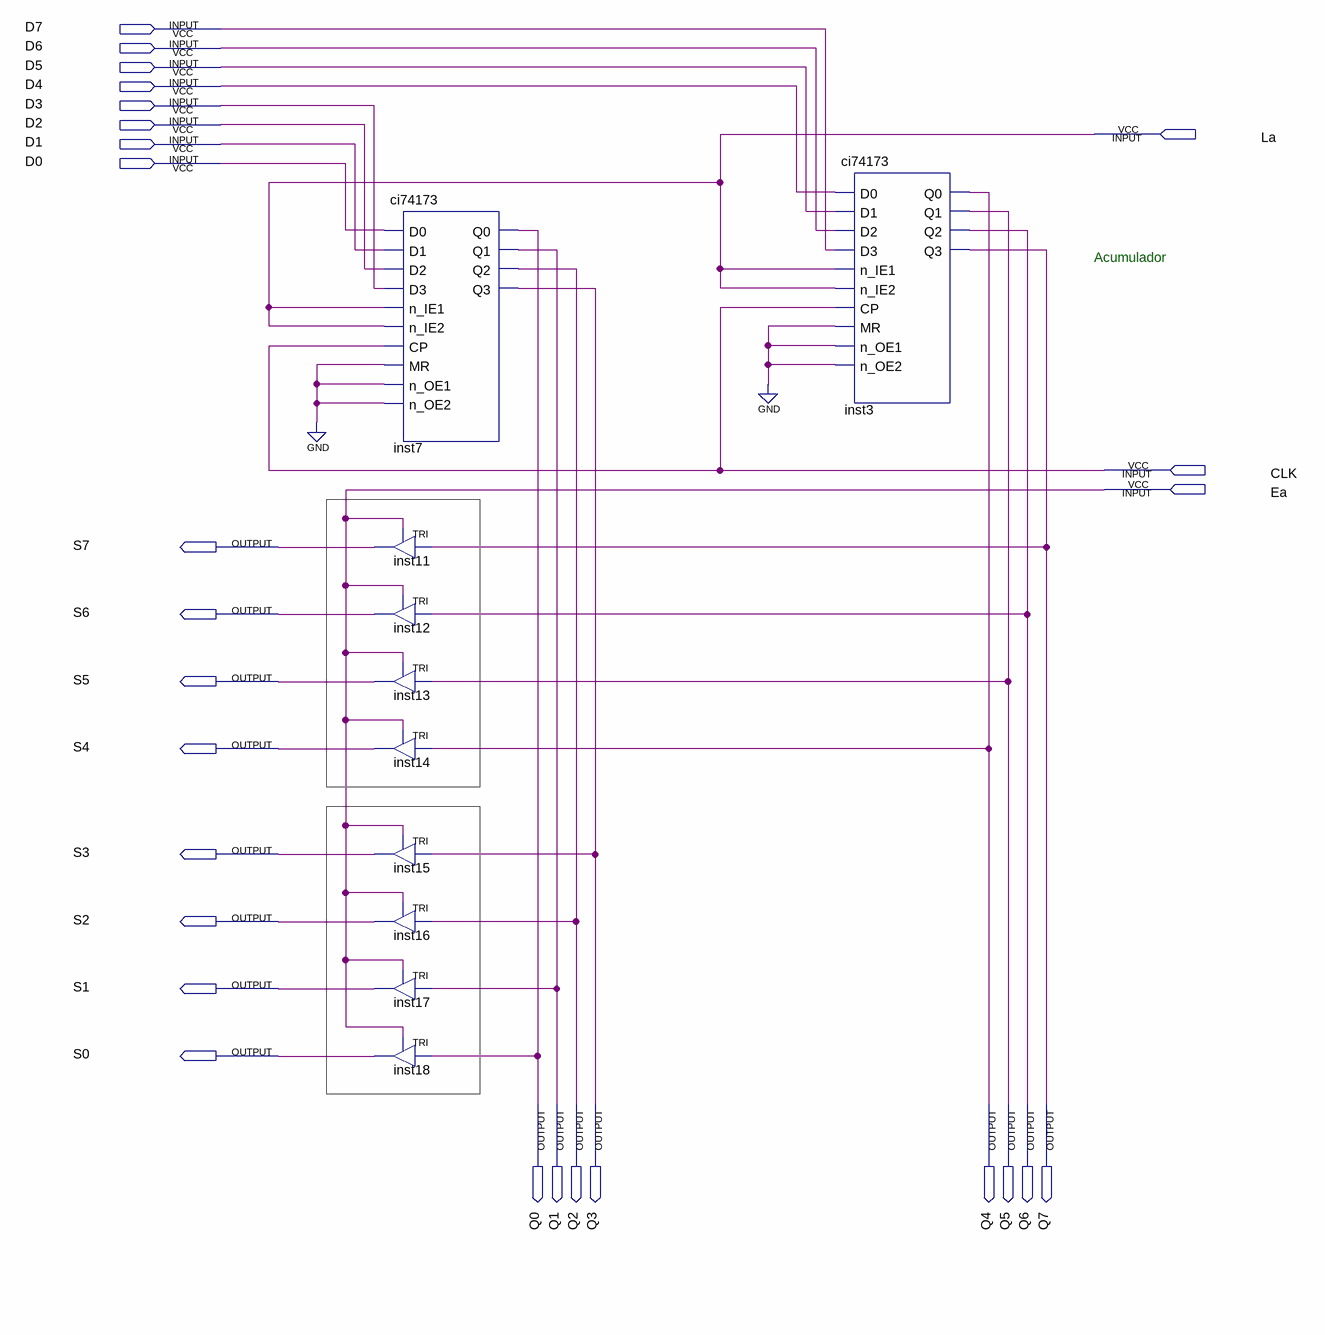
[diagram p0: schematic sheet]
// Quartus schematic Acumulador.bdf as structural Verilog: 10 symbols, 27 pins
module Acumulador (
  input  D7,
  input  D6,
  input  D5,
  input  D4,
  input  D3,
  input  D2,
  input  La,
  input  D1,
  input  D0,
  input  CLK,
  input  Ea,
  output S7,
  output S6,
  output S5,
  output S4,
  output S3,
  output S2,
  output S1,
  output S0,
  output Q0,
  output Q1,
  output Q2,
  output Q3,
  output Q4,
  output Q5,
  output Q6,
  output Q7
);

  ci74173 inst7 (
    .D0(D0), .D1(D1), .D2(D2), .D3(D3), .n_IE1(La), .n_IE2(La), .CP(CLK), .MR(1'b0), .n_OE1(1'b0),
    .n_OE2(1'b0), .Q0(Q0), .Q1(Q1), .Q2(Q2), .Q3(Q3));
  TRI inst11 (.IN(Q7), .OE(Ea), .OUT(S7));
  TRI inst12 (.IN(Q6), .OE(Ea), .OUT(S6));
  TRI inst13 (.IN(Q5), .OE(Ea), .OUT(S5));
  TRI inst14 (.IN(Q4), .OE(Ea), .OUT(S4));
  TRI inst15 (.IN(Q3), .OE(Ea), .OUT(S3));
  TRI inst16 (.IN(Q2), .OE(Ea), .OUT(S2));
  TRI inst17 (.IN(Q1), .OE(Ea), .OUT(S1));
  TRI inst18 (.IN(Q0), .OE(Ea), .OUT(S0));
  ci74173 inst3 (
    .D0(D4), .D1(D5), .D2(D6), .D3(D7), .n_IE1(La), .n_IE2(La), .CP(CLK), .MR(1'b0), .n_OE1(1'b0),
    .n_OE2(1'b0), .Q0(Q4), .Q1(Q5), .Q2(Q6), .Q3(Q7));

  // Notes on the sheet:
  //   Acumulador
endmodule
